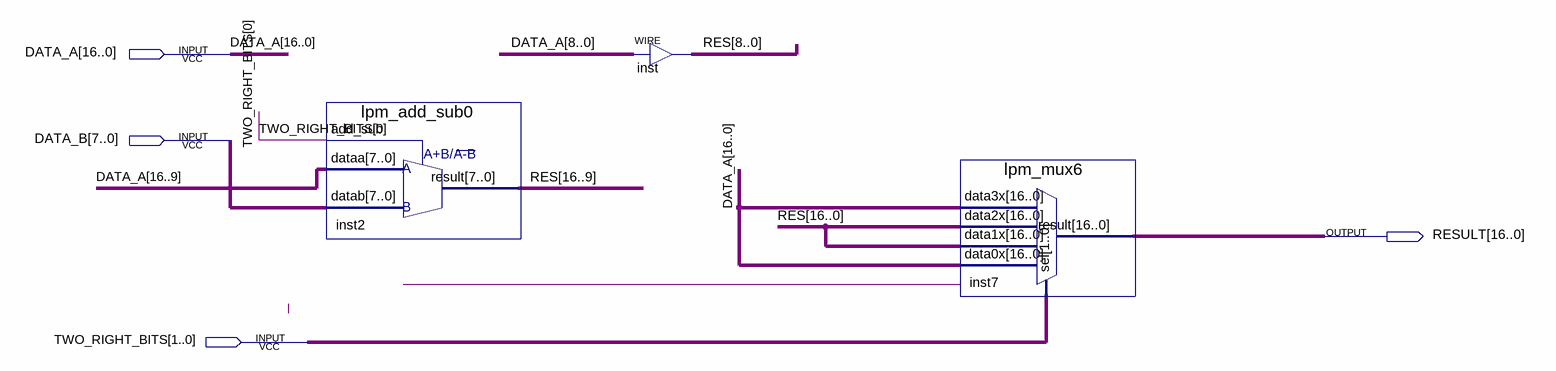
[diagram p0: schematic sheet]
// Quartus schematic Booth_Complex_Adder.bdf as structural Verilog: 3 symbols, 4 pins
module Booth_Complex_Adder (
  input  [16:0] DATA_A,
  input  [7:0] DATA_B,
  input  [1:0] TWO_RIGHT_BITS,
  output [16:0] RESULT
);

  wire [16:0] RES;

  lpm_add_sub0 inst2 (.add_sub(TWO_RIGHT_BITS[0]), .dataa(DATA_A[16:9]), .datab(DATA_B), .result(RES[16:9]));
  assign RES[8:0] = DATA_A[8:0];  // WIRE inst
  lpm_mux6 inst7 (.data3x(DATA_A), .data2x(RES), .data1x(RES), .data0x(DATA_A), .sel(TWO_RIGHT_BITS), .result(RESULT));
endmodule
